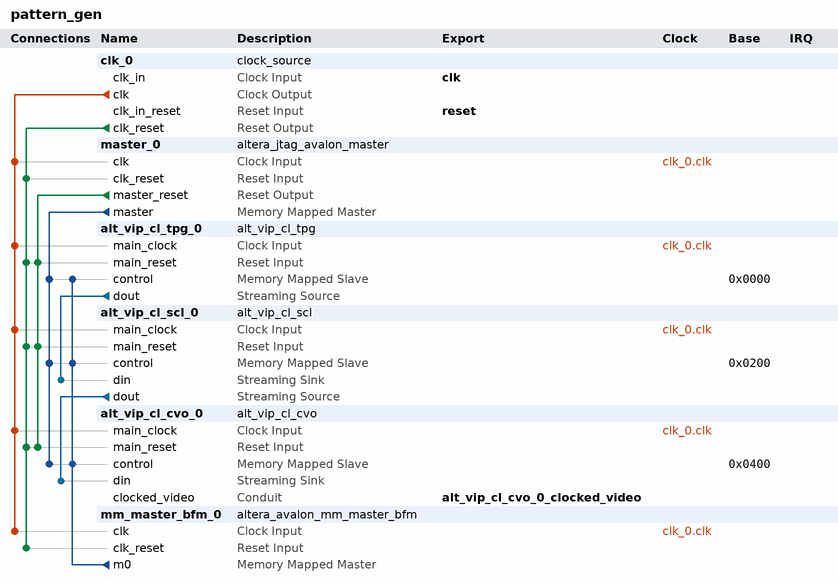
[diagram p0: system contents]
# Platform Designer (Qsys) system pattern_gen, Cyclone V 5CGXBC7D7F31C8
# Parameters at their usual value, and those the tool derives, are not listed.
package require -exact qsys 16.1
create_system pattern_gen
set_project_property DEVICE_FAMILY {Cyclone V}
set_project_property DEVICE 5CGXBC7D7F31C8

add_instance clk_0 clock_source 16.1
set_instance_parameter_value clk_0 clockFrequency 148500000

add_instance master_0 altera_jtag_avalon_master 16.1

add_instance alt_vip_cl_tpg_0 alt_vip_cl_tpg 16.1
set_instance_parameter_value alt_vip_cl_tpg_0 BITS_PER_SYMBOL 8
set_instance_parameter_value alt_vip_cl_tpg_0 COLOR_PLANES_ARE_IN_PARALLEL 1
set_instance_parameter_value alt_vip_cl_tpg_0 COLOR_SPACE RGB
set_instance_parameter_value alt_vip_cl_tpg_0 FAMILY {Cyclone V}
set_instance_parameter_value alt_vip_cl_tpg_0 INTERLACING prog
set_instance_parameter_value alt_vip_cl_tpg_0 MAX_HEIGHT 1080
set_instance_parameter_value alt_vip_cl_tpg_0 MAX_WIDTH 1920
set_instance_parameter_value alt_vip_cl_tpg_0 NUMBER_OF_COLOR_PLANES 2
set_instance_parameter_value alt_vip_cl_tpg_0 OUTPUT_FORMAT 4.4.4
set_instance_parameter_value alt_vip_cl_tpg_0 PATTERN colorbars
set_instance_parameter_value alt_vip_cl_tpg_0 PIXELS_IN_PARALLEL 1
set_instance_parameter_value alt_vip_cl_tpg_0 RUNTIME_CONTROL 1
set_instance_parameter_value alt_vip_cl_tpg_0 UNIFORM_VALUE_BCR 16
set_instance_parameter_value alt_vip_cl_tpg_0 UNIFORM_VALUE_GCB 16
set_instance_parameter_value alt_vip_cl_tpg_0 UNIFORM_VALUE_RY 16

add_instance alt_vip_cl_scl_0 alt_vip_cl_scl 16.1
set_instance_parameter_value alt_vip_cl_scl_0 ALGORITHM_NAME NEAREST_NEIGHBOUR
set_instance_parameter_value alt_vip_cl_scl_0 ALWAYS_DOWNSCALE 0
set_instance_parameter_value alt_vip_cl_scl_0 ARE_IDENTICAL 0
set_instance_parameter_value alt_vip_cl_scl_0 BITS_PER_SYMBOL 8
set_instance_parameter_value alt_vip_cl_scl_0 DEFAULT_EDGE_THRESH 7
set_instance_parameter_value alt_vip_cl_scl_0 DEFAULT_LOWER_BLUR 0
set_instance_parameter_value alt_vip_cl_scl_0 DEFAULT_UPPER_BLUR 0
set_instance_parameter_value alt_vip_cl_scl_0 ENABLE_FIR 0
set_instance_parameter_value alt_vip_cl_scl_0 EXTRA_PIPELINING 0
set_instance_parameter_value alt_vip_cl_scl_0 FAMILY {Cyclone V}
set_instance_parameter_value alt_vip_cl_scl_0 H_BANKS 1
set_instance_parameter_value alt_vip_cl_scl_0 H_COEFF_FILE {<enter file name (including full path)>}
set_instance_parameter_value alt_vip_cl_scl_0 H_FRACTION_BITS 7
set_instance_parameter_value alt_vip_cl_scl_0 H_FUNCTION LANCZOS_2
set_instance_parameter_value alt_vip_cl_scl_0 H_INTEGER_BITS 1
set_instance_parameter_value alt_vip_cl_scl_0 H_PHASES 16
set_instance_parameter_value alt_vip_cl_scl_0 H_SIGNED 1
set_instance_parameter_value alt_vip_cl_scl_0 H_SYMMETRIC 0
set_instance_parameter_value alt_vip_cl_scl_0 H_TAPS 8
set_instance_parameter_value alt_vip_cl_scl_0 IS_420 0
set_instance_parameter_value alt_vip_cl_scl_0 IS_422 1
set_instance_parameter_value alt_vip_cl_scl_0 LIMITED_READBACK 0
set_instance_parameter_value alt_vip_cl_scl_0 LOAD_AT_RUNTIME 0
set_instance_parameter_value alt_vip_cl_scl_0 MAX_IN_HEIGHT 1080
set_instance_parameter_value alt_vip_cl_scl_0 MAX_IN_WIDTH 1920
set_instance_parameter_value alt_vip_cl_scl_0 MAX_OUT_HEIGHT 1080
set_instance_parameter_value alt_vip_cl_scl_0 MAX_OUT_WIDTH 1920
set_instance_parameter_value alt_vip_cl_scl_0 NO_BLANKING 0
set_instance_parameter_value alt_vip_cl_scl_0 PIXELS_IN_PARALLEL 1
set_instance_parameter_value alt_vip_cl_scl_0 PRESERVE_BITS 0
set_instance_parameter_value alt_vip_cl_scl_0 RUNTIME_CONTROL 1
set_instance_parameter_value alt_vip_cl_scl_0 SYMBOLS_IN_PAR 3
set_instance_parameter_value alt_vip_cl_scl_0 SYMBOLS_IN_SEQ 1
set_instance_parameter_value alt_vip_cl_scl_0 USER_PACKET_FIFO_DEPTH 0
set_instance_parameter_value alt_vip_cl_scl_0 USER_PACKET_SUPPORT PASSTHROUGH
set_instance_parameter_value alt_vip_cl_scl_0 V_BANKS 1
set_instance_parameter_value alt_vip_cl_scl_0 V_COEFF_FILE {<enter file name (including full path)>}
set_instance_parameter_value alt_vip_cl_scl_0 V_FRACTION_BITS 7
set_instance_parameter_value alt_vip_cl_scl_0 V_FUNCTION LANCZOS_2
set_instance_parameter_value alt_vip_cl_scl_0 V_INTEGER_BITS 1
set_instance_parameter_value alt_vip_cl_scl_0 V_PHASES 16
set_instance_parameter_value alt_vip_cl_scl_0 V_SIGNED 1
set_instance_parameter_value alt_vip_cl_scl_0 V_SYMMETRIC 0
set_instance_parameter_value alt_vip_cl_scl_0 V_TAPS 8

add_instance alt_vip_cl_cvo_0 alt_vip_cl_cvo 16.1
set_instance_parameter_value alt_vip_cl_cvo_0 ACCEPT_COLOURS_IN_SEQ 0
set_instance_parameter_value alt_vip_cl_cvo_0 ANC_LINE 0
set_instance_parameter_value alt_vip_cl_cvo_0 AP_LINE 0
set_instance_parameter_value alt_vip_cl_cvo_0 BPS 8
set_instance_parameter_value alt_vip_cl_cvo_0 CLOCKS_ARE_SAME 1
set_instance_parameter_value alt_vip_cl_cvo_0 COLOUR_PLANES_ARE_IN_PARALLEL 1
set_instance_parameter_value alt_vip_cl_cvo_0 CONTEXT_WIDTH 8
set_instance_parameter_value alt_vip_cl_cvo_0 DST_WIDTH 8
set_instance_parameter_value alt_vip_cl_cvo_0 FIELD0_ANC_LINE 0
set_instance_parameter_value alt_vip_cl_cvo_0 FIELD0_V_BACK_PORCH 0
set_instance_parameter_value alt_vip_cl_cvo_0 FIELD0_V_BLANK 0
set_instance_parameter_value alt_vip_cl_cvo_0 FIELD0_V_FRONT_PORCH 0
set_instance_parameter_value alt_vip_cl_cvo_0 FIELD0_V_RISING_EDGE 0
set_instance_parameter_value alt_vip_cl_cvo_0 FIELD0_V_SYNC_LENGTH 0
set_instance_parameter_value alt_vip_cl_cvo_0 FIFO_DEPTH 1920
set_instance_parameter_value alt_vip_cl_cvo_0 F_FALLING_EDGE 0
set_instance_parameter_value alt_vip_cl_cvo_0 F_RISING_EDGE 0
set_instance_parameter_value alt_vip_cl_cvo_0 GENERATE_SYNC 0
set_instance_parameter_value alt_vip_cl_cvo_0 H_ACTIVE_PIXELS 1920
set_instance_parameter_value alt_vip_cl_cvo_0 H_BACK_PORCH 220
set_instance_parameter_value alt_vip_cl_cvo_0 H_BLANK 0
set_instance_parameter_value alt_vip_cl_cvo_0 H_FRONT_PORCH 110
set_instance_parameter_value alt_vip_cl_cvo_0 H_SYNC_LENGTH 40
set_instance_parameter_value alt_vip_cl_cvo_0 INTERLACED 0
set_instance_parameter_value alt_vip_cl_cvo_0 LOW_LATENCY 0
set_instance_parameter_value alt_vip_cl_cvo_0 NO_OF_CHANNELS 1
set_instance_parameter_value alt_vip_cl_cvo_0 NO_OF_MODES 1
set_instance_parameter_value alt_vip_cl_cvo_0 NUMBER_OF_COLOUR_PLANES 3
set_instance_parameter_value alt_vip_cl_cvo_0 PIXELS_IN_PARALLEL 1
set_instance_parameter_value alt_vip_cl_cvo_0 SRC_WIDTH 8
set_instance_parameter_value alt_vip_cl_cvo_0 STD_WIDTH 1
set_instance_parameter_value alt_vip_cl_cvo_0 TASK_WIDTH 8
set_instance_parameter_value alt_vip_cl_cvo_0 THRESHOLD 1919
set_instance_parameter_value alt_vip_cl_cvo_0 USE_CONTROL 1
set_instance_parameter_value alt_vip_cl_cvo_0 USE_EMBEDDED_SYNCS 0
set_instance_parameter_value alt_vip_cl_cvo_0 V_ACTIVE_LINES 1080
set_instance_parameter_value alt_vip_cl_cvo_0 V_BACK_PORCH 20
set_instance_parameter_value alt_vip_cl_cvo_0 V_BLANK 0
set_instance_parameter_value alt_vip_cl_cvo_0 V_FRONT_PORCH 5
set_instance_parameter_value alt_vip_cl_cvo_0 V_SYNC_LENGTH 5

add_instance mm_master_bfm_0 altera_avalon_mm_master_bfm 16.1
set_instance_parameter_value mm_master_bfm_0 ADDRESS_UNITS SYMBOLS
set_instance_parameter_value mm_master_bfm_0 AV_ADDRESS_W 32
set_instance_parameter_value mm_master_bfm_0 AV_ALWAYS_BURST_MAX_BURST 0
set_instance_parameter_value mm_master_bfm_0 AV_BURSTCOUNT_W 3
set_instance_parameter_value mm_master_bfm_0 AV_BURST_BNDR_ONLY 1
set_instance_parameter_value mm_master_bfm_0 AV_BURST_LINEWRAP 1
set_instance_parameter_value mm_master_bfm_0 AV_CONSTANT_BURST_BEHAVIOR 1
set_instance_parameter_value mm_master_bfm_0 AV_FIX_READ_LATENCY 1
set_instance_parameter_value mm_master_bfm_0 AV_MAX_PENDING_WRITES 0
set_instance_parameter_value mm_master_bfm_0 AV_NUMSYMBOLS 4
set_instance_parameter_value mm_master_bfm_0 AV_READRESPONSE_W 8
set_instance_parameter_value mm_master_bfm_0 AV_READ_WAIT_TIME 1
set_instance_parameter_value mm_master_bfm_0 AV_WRITERESPONSE_W 8
set_instance_parameter_value mm_master_bfm_0 USE_BURSTCOUNT 1
set_instance_parameter_value mm_master_bfm_0 USE_BYTE_ENABLE 1
set_instance_parameter_value mm_master_bfm_0 USE_READ 1
set_instance_parameter_value mm_master_bfm_0 USE_READ_DATA 1
set_instance_parameter_value mm_master_bfm_0 USE_READ_DATA_VALID 1
set_instance_parameter_value mm_master_bfm_0 USE_WAIT_REQUEST 1
set_instance_parameter_value mm_master_bfm_0 VHDL_ID 0

# connections
add_connection clk_0.clk alt_vip_cl_cvo_0.main_clock clock
add_connection clk_0.clk alt_vip_cl_scl_0.main_clock clock
add_connection clk_0.clk alt_vip_cl_tpg_0.main_clock clock
add_connection clk_0.clk master_0.clk clock
add_connection clk_0.clk mm_master_bfm_0.clk clock
add_connection clk_0.clk_reset alt_vip_cl_cvo_0.main_reset reset
add_connection clk_0.clk_reset alt_vip_cl_scl_0.main_reset reset
add_connection clk_0.clk_reset alt_vip_cl_tpg_0.main_reset reset
add_connection clk_0.clk_reset master_0.clk_reset reset
add_connection clk_0.clk_reset mm_master_bfm_0.clk_reset reset
add_connection master_0.master_reset alt_vip_cl_cvo_0.main_reset reset
add_connection master_0.master_reset alt_vip_cl_scl_0.main_reset reset
add_connection master_0.master_reset alt_vip_cl_tpg_0.main_reset reset
add_connection master_0.master alt_vip_cl_cvo_0.control avalon
set_connection_parameter_value master_0.master/alt_vip_cl_cvo_0.control baseAddress 0x0400
add_connection master_0.master alt_vip_cl_scl_0.control avalon
set_connection_parameter_value master_0.master/alt_vip_cl_scl_0.control baseAddress 0x0200
add_connection master_0.master alt_vip_cl_tpg_0.control avalon
set_connection_parameter_value master_0.master/alt_vip_cl_tpg_0.control baseAddress 0x0000
add_connection mm_master_bfm_0.m0 alt_vip_cl_cvo_0.control avalon
set_connection_parameter_value mm_master_bfm_0.m0/alt_vip_cl_cvo_0.control baseAddress 0x0400
add_connection mm_master_bfm_0.m0 alt_vip_cl_scl_0.control avalon
set_connection_parameter_value mm_master_bfm_0.m0/alt_vip_cl_scl_0.control baseAddress 0x0200
add_connection mm_master_bfm_0.m0 alt_vip_cl_tpg_0.control avalon
set_connection_parameter_value mm_master_bfm_0.m0/alt_vip_cl_tpg_0.control baseAddress 0x0000
add_connection alt_vip_cl_scl_0.dout alt_vip_cl_cvo_0.din avalon_streaming
add_connection alt_vip_cl_tpg_0.dout alt_vip_cl_scl_0.din avalon_streaming

# exported interfaces
add_interface alt_vip_cl_cvo_0_clocked_video conduit end
set_interface_property alt_vip_cl_cvo_0_clocked_video EXPORT_OF alt_vip_cl_cvo_0.clocked_video
add_interface clk clock sink
set_interface_property clk EXPORT_OF clk_0.clk_in
add_interface reset reset sink
set_interface_property reset EXPORT_OF clk_0.clk_in_reset

set_interconnect_requirement {$system} qsys_mm.clockCrossingAdapter HANDSHAKE
set_interconnect_requirement {$system} qsys_mm.enableEccProtection FALSE
set_interconnect_requirement {$system} qsys_mm.insertDefaultSlave FALSE
set_interconnect_requirement {$system} qsys_mm.maxAdditionalLatency 1

save_system pattern_gen.qsys
